# Altium schematic sheet RESET.SchDoc
size A4
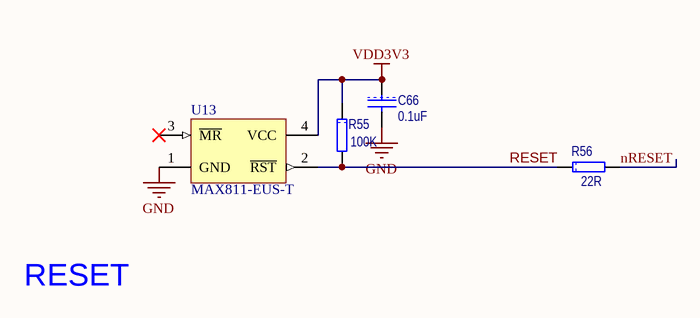
[diagram p0: RESET.SchDoc]

## Parts
C66  0.1uF  [1608[0603]]
R55  100K  [1608[0603]R]
R56  22R  [1608[0603]R]
U13  MAX811-EUS-T  [SOT143_N]

## Nets
GND: C66.2 U13.1(GND)
VDD3V3: C66.1 R55.1 U13.4(VCC)
nRESET: R56.2
RESET: R55.2 R56.1 U13.2(~{RST})

Not connected (* = marked no-connect by the designer): U13 3(~{MR})*

## Notes on the sheet
- RESET

## Library data of the parts
C66 = CAP: Capacitor; Manufacturer: TDK; Type: 无铅电容; Model: C0603X7R1H104K; Value: 0.1uF
R55 = RES: Manufacturer: vishay; Model: RT0603DRD7D10KL; Parameters: 50V 1/10W 0.5%; Type: 无铅电阻; Value: 100K
R56 = RES: Manufacturer: vishay; Model: CRCW060322R0KKEDTR; Value: 22R; Type: 无铅电阻
U13 = MAX811-EUS-T: IC; Published: 16-Jan-2001; LatestRevisionDate: 29-May-2009; LatestRevisionNote: IPC-7351 Footprint Added.; DatasheetVersion: Feb-1998; PackageVersion: Feb-1998; PackageReference: SOT143; Publisher: Altium Limited; PackageDescription: 4-Pin SOT-143 Package 1.9 mm Pitch, 2.3 mm Lead Span; ComponentLink1Description: Manufacturer Link; ComponentLink1URL: http://www.maxim-ic.com/; ComponentLink2Description: Datasheet; ComponentLink2URL: http://pdfserv.maxim-ic.com/en/ds/MAX811-MAX812.pdf; Supplier 1: Digi-Key; Supplier Part Number 1: MAX811SEUS+TTR-ND